# Altium schematic sheet [11] - POWERS.SchDoc
size A3; CompanyName: FPT-FTI copporation; Address1: FPT Building Duy Tan; Address2: Floor 4,; DocumentNumber: 11; SheetNumber: 11; SheetTotal: 13; NameAuthor: Angle Vu
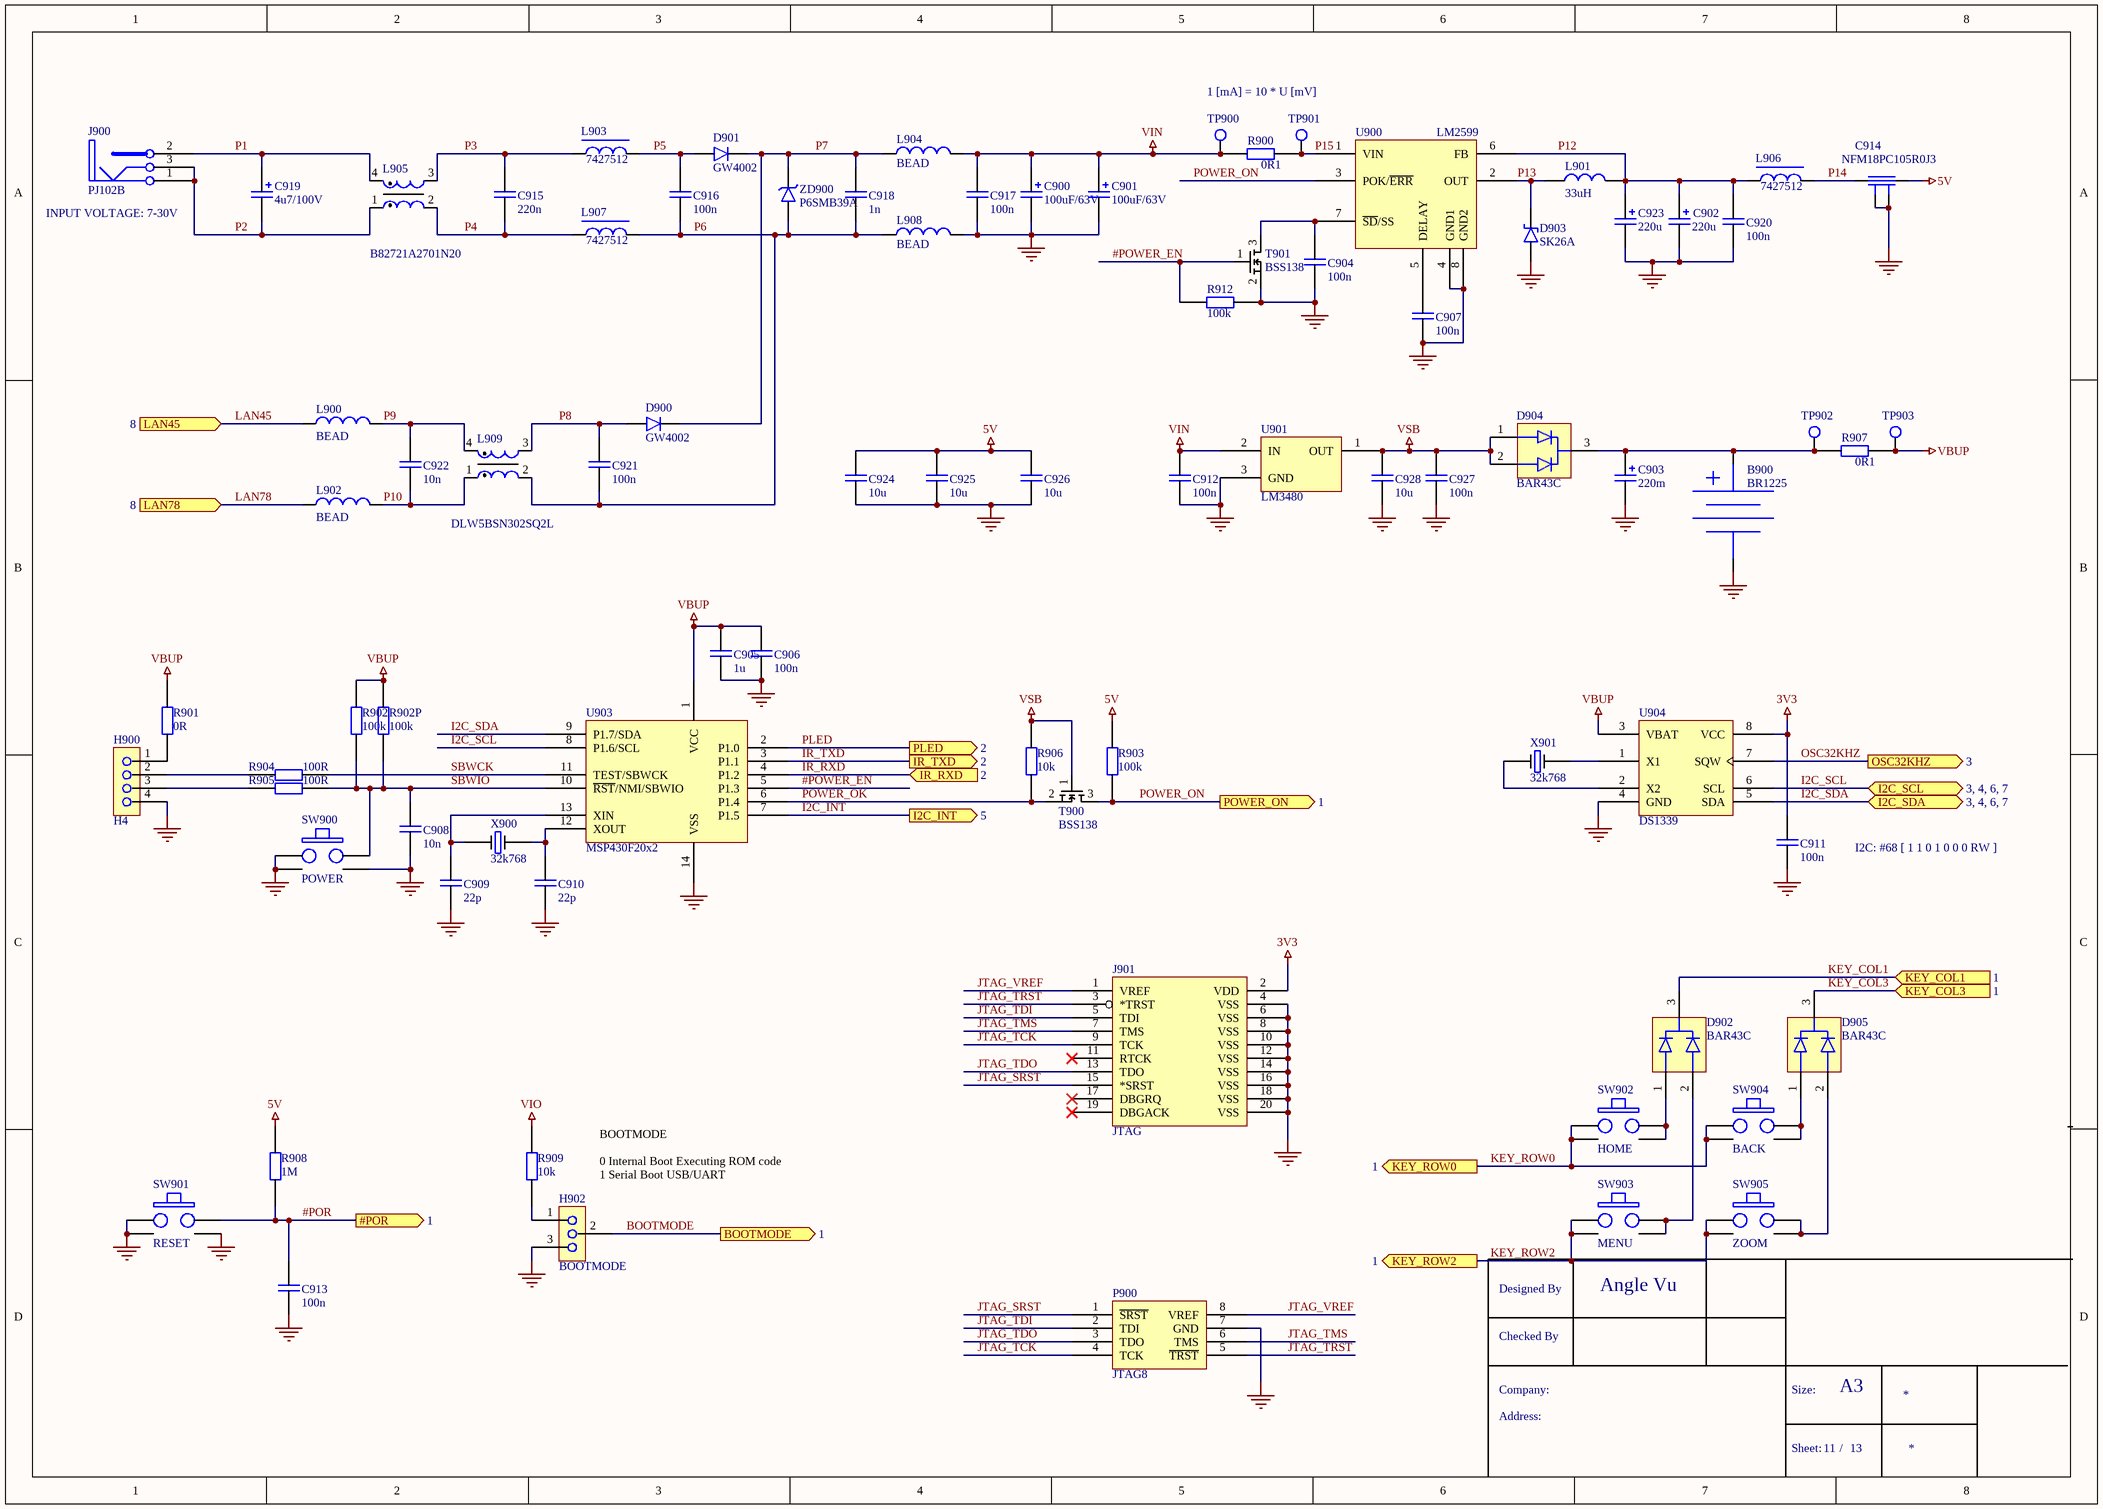
[diagram p0: [11] - POWERS.SchDoc]

## Parts
B900  BR1225  [BR1225]
C900  100uF/63V  [EC5/10]
C901  100uF/63V  [EC5/10]
C902  220u  [EC5/10]
C903  220m  [SC5/13]
C904  100n  [0603]
C905  1u  [0603]
C906  100n  [0603]
C907  100n  [0603]
C908  10n  [0603]
C909  22p  [0603]
C910  22p  [0603]
C911  100n  [0603]
C912  100n  [0603]
C913  100n  [0603]
C914  NFM18PC105R0J3  [NFM18P]
C915  220n  [1206]
C916  100n  [1206]
C917  100n  [1206]
C918  1n  [0805]
C919  4u7/100V  [EC2/5]
C920  100n  [0603]
C921  100n  [0603]
C922  10n  [0603]
C923  220u  [EC5/10]
C924  10u  [0805]
C925  10u  [0805]
C926  10u  [0805]
C927  100n  [0603]
C928  10u  [0805]
D900  GW4002  [MELF]
D901  GW4002  [MELF]
D902  BAR43C  [SOT23]
D903  SK26A  [SMB]
D904  BAR43C  [SOT23]
D905  BAR43C  [SOT23]
H900  H4  [H1x4]
H902  BOOTMODE  [H1x3]
J900  PJ102B  [POWER_JACK_5.5/2.1MM_NS]
J901  JTAG  [H2x10]
L900  BEAD  [0805]
L901  33uH  [L127_NS]
L902  BEAD  [0805]
L903  7427512  [7427512]
L904  BEAD  [0805]
L905  B82721A2701N20  [42H17]
L906  7427512  [7427512]
L907  7427512  [7427512]
L908  BEAD  [0805]
L909  DLW5BSN302SQ2L  [DLW5BSN]
P900  JTAG8  [47041-0001]
R900  0R1  [0603]
R901  0R  [0603]
R902  100k  [0603]
R902P  100k  [0603]
R903  100k  [0603]
R904  100R  [0603]
R905  100R  [0603]
R906  10k  [0603]
R907  0R1  [0603]
R908  1M  [0603]
R909  10k  [0603]
R912  100k  [0603]
SW900  POWER  [BUTTON_RA_NS]
SW901  RESET  [BUTTON_RA_NS]
SW902  HOME  [BUTTON_KSM61X]
SW903  MENU  [BUTTON_KSM61X]
SW904  BACK  [BUTTON_KSM61X]
SW905  ZOOM  [BUTTON_KSM61X]
T900  BSS138  [SOT23]
T901  BSS138  [SOT23]
TP900  TESTPOINT  [TESTPOINT_2mm]  (value not drawn)
TP901  TESTPOINT  [TESTPOINT_2mm]  (value not drawn)
TP902  TESTPOINT  [TESTPOINT_2mm]  (value not drawn)
TP903  TESTPOINT  [TESTPOINT_2mm]  (value not drawn)
U900  LM2599  [TO263_7]
U901  LM3480  [SOT23]
U903  MSP430F20x2  [TSSOP14]
U904  DS1339  [uSOP8]
X900  32k768  [SMQ32S]
X901  32k768  [SMQ32S]
ZD900  P6SMB39A  [DO214AA]

## Ports
#POR (out, see 1), BOOTMODE (out, see 1), I2C_INT (out, see 5), I2C_SCL (bidir, see 3, 4, 6, 7), I2C_SDA (bidir, see 3, 4, 6, 7), IR_RXD (in, see 2), IR_TXD (out, see 2), KEY_COL1 (in, see 1), KEY_COL3 (in, see 1), KEY_ROW0 (out, see 1), KEY_ROW2 (out, see 1), LAN45 (in, see 8), LAN78 (in, see 8), OSC32KHZ (out, see 3), PLED (out, see 2), POWER_ON (out, see 1)

## Nets
3V3: C911.2 J901.2(VDD) U904.8(VCC)
5V: C914.3 C924.2 C925.2 C926.2 R903.2 R908.2
GND: B900.2(CATHODE) C900.2 C901.2 C902.2 C903.2 C904.1 C905.1 C906.2 C907.1 C908.2 C909.1 C910.1 C911.1 C912.1 C913.1 C914.2 C914.4 C917.2 C920.2 C923.2 C924.1 C925.1 C926.1 C927.1 C928.1 D903.2 H900.4 H902.3 J901.4(VSS) J901.6(VSS) J901.8(VSS) J901.10(VSS) J901.12(VSS) J901.14(VSS) J901.16(VSS) J901.18(VSS) J901.20(VSS) L908.1 P900.7(GND) R912.1 SW900.2 SW900.3 SW900.4 SW901.2 SW901.3 SW901.4 T901.2(S) U900.4(GND1) U900.8(GND2) U901.3(GND) U903.14(VSS) U904.4(GND)
VBUP: C905.2 C906.1 R901.2 R902.2 R902P.2 R907.2 TP903.1 U903.1(VCC) U904.3(VBAT)
VIN: C900.1 C901.1 C912.2 C917.1 L904.1 R900.1 TP900.1 U901.2(IN)
VIO: R909.2
VSB: C927.2 C928.2 D904.1 D904.2 R906.1 T900.1(G) U901.1(OUT)
#POR: C913.2 R908.1 SW901.1 ; port #POR
#POWER_EN: R912.2 T901.1(G) U903.5(P1.3)
BOOTMODE: H902.2 ; port BOOTMODE
I2C_INT: U903.7(P1.5) ; port I2C_INT
I2C_SCL: U903.8(P1.6/SCL) U904.6(SCL) ; port I2C_SCL
I2C_SDA: U903.9(P1.7/SDA) U904.5(SDA) ; port I2C_SDA
IR_RXD: U903.4(P1.2) ; port IR_RXD
IR_TXD: U903.3(P1.1) ; port IR_TXD
JTAG_SRST: J901.15(*SRST) P900.1(~{SRST})
JTAG_TCK: J901.9(TCK) P900.4(TCK)
JTAG_TDI: J901.5(TDI) P900.2(TDI)
JTAG_TDO: J901.13(TDO) P900.3(TDO)
JTAG_TMS: J901.7(TMS) P900.6(TMS)
JTAG_TRST: J901.3(*TRST) P900.5(~{TRST})
JTAG_VREF: J901.1(VREF) P900.8(VREF)
KEY_COL1: D902.3 ; port KEY_COL1
KEY_COL3: D905.3 ; port KEY_COL3
KEY_ROW0: SW902.1 SW902.3 SW904.1 SW904.3 ; port KEY_ROW0
KEY_ROW2: SW903.1 SW903.3 SW905.1 SW905.3 ; port KEY_ROW2
LAN45: L900.1 ; port LAN45
LAN78: L902.1 ; port LAN78
OSC32KHZ: U904.7(SQW) ; port OSC32KHZ
P1: C919.1 J900.2 L905.4
P2: C919.2 J900.1 J900.3 L905.1
P3: C915.1 L903.2 L905.3
P4: C915.2 L905.2 L907.2
P5: C916.1 D901.1 L903.1
P6: C916.2 C918.2 C921.2 L907.1 L908.2 L909.2 ZD900.2
P7: C918.1 D900.2 D901.2 L904.2 ZD900.1
P8: C921.1 D900.1 L909.3
P9: C922.1 L900.2 L909.4
P10: C922.2 L902.2 L909.1
P12: C902.1 C920.1 C923.1 L901.2 L906.2 U900.6(FB)
P13: D903.1 L901.1 U900.2(OUT)
P14: C914.1 L906.1
P15: R900.2 TP901.1 U900.1(VIN)
PLED: U903.2(P1.0) ; port PLED
POWER_OK: R906.2 T900.2(S) U903.6(P1.4)
POWER_ON: R903.1 T900.3(D) U900.3(POK/~{ERR}) ; port POWER_ON
SBWCK: R904.2 U903.11(TEST/SBWCK)
SBWIO: C908.1 R902.1 R902P.1 R905.2 SW900.1 U903.10(~{RST}/NMI/SBWIO)
NetB900_1: B900.1(ANODE) C903.1 D904.3 R907.1 TP902.1
NetC904_2: C904.2 T901.3(D) U900.7(~{SD}/SS)
NetC907_2: C907.2 U900.5(DELAY)
NetC909_2: C909.2 U903.13(XIN) X900.1
NetC910_2: C910.2 U903.12(XOUT) X900.2
NetD902_1: D902.1 SW902.2 SW902.4
NetD902_2: D902.2 SW903.2 SW903.4
NetD905_1: D905.1 SW904.2 SW904.4
NetD905_2: D905.2 SW905.2 SW905.4
NetH900_1: H900.1 R901.1
NetH900_2: H900.2 R904.1
NetH900_3: H900.3 R905.1
NetH902_1: H902.1 R909.1
NetU904_1: U904.1(X1) X901.2
NetU904_2: U904.2(X2) X901.1

Not connected (* = marked no-connect by the designer): J901 11(RTCK)* 17(DBGRQ)* 19(DBGACK)*

## Notes on the sheet
- 1 [mA] = 10 * U [mV]
- (near J900) INPUT VOLTAGE: 7-30V
- I2C: #68 [ 1 1 0 1 0 0 0 RW ]
- (near H902) BOOTMODE
  0	Internal Boot	Executing ROM code
  1	Serial Boot	USB/UART
- Designed By
- Checked By
- Company:
- Size:
- A3
- Address:
- Sheet:
- /

## Library data of the parts
B900 = BATT3V
C900-C903 C919 C923 = C+
C904-C913 C915-C918 C920-C922 C924-C928 = C
C914 = NFL21S: Chip EMIFIL; Producer: Murata; Order number: NFM18PC105R0J3; Component class: C; Assembly type: SMT
D900 D901 = D
D903 = SHD
H902 = H3
J901 = ARMICE20
L900 L902 L904 L908 = FBEAD
L901 = L
L903 L906 L907 = 7427512: 5A EMI ferit L; Producer: Wurth Electronic; Order number: 7427512; Component class: L; Assembly type: SMT
L905 = 42H17: Current compensated choke 2x10mH/700mA; Producer: Epcos; Component class: L; Assembly type: TH; Order number: B82721A2701N20
L909 = DLW5BSN152SQ2L: EMI Suppression filter 1A; Producer: Murata; Component class: L; Assembly type: SMT; Order number: DLW5BSN302SQ2L
R900-R902 R902P R903-R909 R912 = R
SW900-SW905 = PBSW
TP900-TP903 = TESTPOINT: Testpoint pad; Order number: no component; Component class: TP; Producer: n/a; Assembly type: no component
X900 X901 = XTAL
ZD900 = ZD